# EAGLE design Pucati (EAGLE 7.7.0)
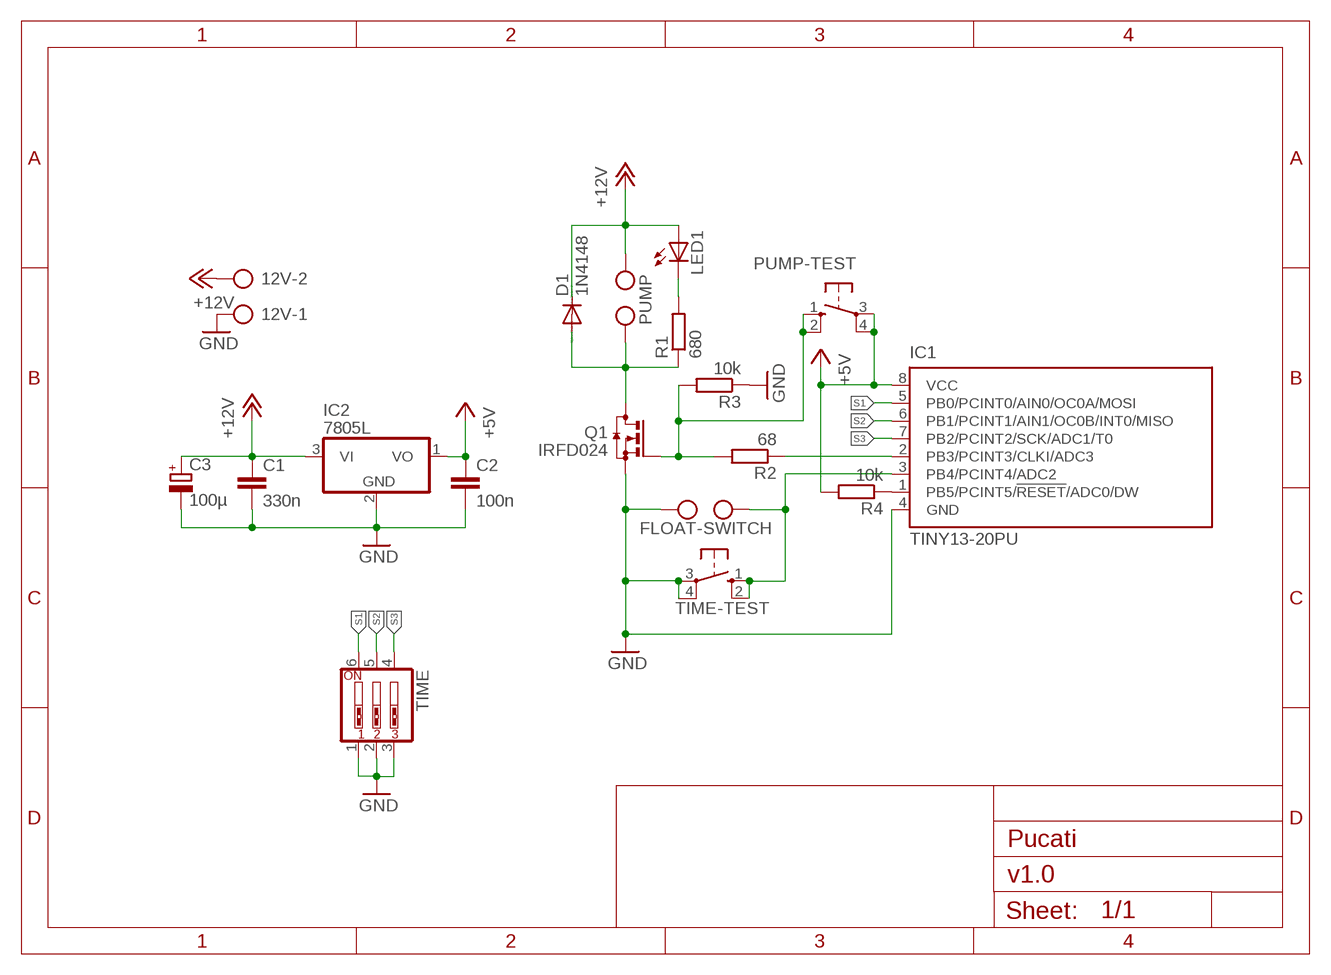
[diagram p0: schematic, sheet 1]

## Parts
12V  AK500/2  [AK500/2]
C1  330n  C-EUC1206  [C1206]
C2  100n  C-EUC1206  [C1206]
C3  100µ  CPOL-EUE2.5-5  [E2,5-5]
D1  1N4148  1N4148DO35-10  [DO35-10]
FLOAT-SWITCH  AK500/2  [AK500/2]
IC1  TINY13-20PU  [DIL08]
IC2  7805L  [TO92]
LED1  LED5MM  [LED5MM]
PUMP  AK500/2  [AK500/2]
PUMP-TEST  10-XX  [B3F-10XX]
Q1  IRFD024  [C370-01]
R1  680  R-EU_R1206  [R1206]
R2  68  R-EU_R1206  [R1206]
R3  10k  R-EU_R1206  [R1206]
R4  10k  R-EU_R1206  [R1206]
TIME  SW_DIP-3  [EDG-03]
TIME-TEST  10-XX  [B3F-10XX]

## Nets
+5V: C2.1 IC1.8(VCC) IC2.1(VO) PUMP-TEST.3(P) PUMP-TEST.4(P1) R4.2
+12V: 12V.2 C1.1 C3.+ D1.C IC2.3(VI) LED1.A PUMP.2
GND: 12V.1 C1.2 C2.2 C3.- FLOAT-SWITCH.2 IC1.4(GND) IC2.2(GND) Q1.S R3.1 TIME-TEST.3(P) TIME-TEST.4(P1) TIME.1 TIME.2 TIME.3
N$1: IC1.1(PB5/PCINT5/!RESET!/ADC0/DW) R4.1
N$2: D1.A PUMP.1 Q1.D Q1.D1(D) R1.1
N$3: LED1.K(C) R1.2
N$4: FLOAT-SWITCH.1 IC1.3(PB4/PCINT4/ADC2) TIME-TEST.1(S) TIME-TEST.2(S1)
N$5: IC1.2(PB3/PCINT3/CLKI/ADC3) R2.1
N$7: PUMP-TEST.1(S) PUMP-TEST.2(S1) Q1.G R2.2 R3.2
S1: IC1.5(PB0/PCINT0/AIN0/OC0A/MOSI) TIME.6
S2: IC1.6(PB1/PCINT1/AIN1/OC0B/INT0/MISO) TIME.5
S3: IC1.7(PB2/PCINT2/SCK/ADC1/T0) TIME.4

## Notes on the sheet
- PUMP
- FLOAT-SWITCH
- v1.0

## Library data of the parts
12V FLOAT-SWITCH PUMP = con-ptr500:AK500/2: CONNECTOR; OC_FARNELL: unknown; OC_NEWARK: unknown
C1 C2 = rcl:C-EU: CAPACITOR, European symbol
C3 = rcl:CPOL-EU: POLARIZED CAPACITOR, European symbol
D1 = diode:1N4148: DIODE high speed (Philips)
IC1 = atmel:TINY13: 8-bit AVR Microcontroller with 1K Bytes In-System Programmable Flash Source: http://www.atmel.com/dyn/resources/prod_documents/2535S.pdf; MPN: ATTINY13-20PU; OC_FARNELL: 9171550; OC_NEWARK: 96K6521
IC2 = linear:78*: Positive VOLTAGE REGULATOR Source: http://cache.national.com/ds/LM/LM78L05.pdf http://www.fairchildsemi.com/ds/LM/LM7805.pdf
LED1 = led:LED: LED OSRAM: - CHIPLED LG R971, LG N971, LY N971, LG Q971, LY Q971, LO R971, LY R971 LH N974, LH R974 LS Q976, LO Q976, LY Q976 LO Q996 - Hyper CHIPLED LW Q18S LB Q993, LB Q99A, LB R99A - SideLED LS A670, LO A670, LY A670, LG A670, LP A670 LB A673, LV A673, LT A673, LW A673 LH A674 LY A675 LS A676, LA A676, LO A676, LY A676, LW A676 LS A679, LY A679, LG A679 - Hyper Micro SIDELED® LS Y876, LA Y876, LO Y876, LY Y876 LT Y87S - SmartLED LW L88C, LW L88S LB L89C, LB L89S, LG L890 LS L89K, LO L89K, LY L89K LS L896, LA L896, LO L896, LY L896 - TOPLED LS T670, LO T670, LY T670, LG T670, LP T670 LSG T670, LSP T670, LSY T670, LOP T670, LYG T670 LG T671, LOG T671, LSG T671 LB T673, LV T673, LT T673, LW T673 LH T674 LS T676, LA T676, LO T676, LY T676, LB T676, LH T676, LSB T676, LW T676 LB T67C, LV T67C, LT T67C, LS T67K, LO T67K, LY T67K, LW E67C LS E67B, LA E67B, LO E67B, LY E67B, LB E67C, LV E67C, LT E67C LW T67C LS T679, LY T679, LG T679 LS T770, LO T770, LY T770, LG T770, LP T770 LB T773, LV T773, LT T773, LW T773 LH T774 LS E675, LA E675, LY E675, LS T675 LS T776, LA T776, LO T776, LY T776, LB T776 LHGB T686 LT T68C, LB T68C - Hyper Mini TOPLED® LB M676 - Mini TOPLED Santana® LG M470 LS M47K, LO M47K, LY M47K Source: http://www.osram.convergy.de LUXEON: - LUMILED® LXK2-PW12-R00, LXK2-PW12-S00, LXK2-PW14-U00, LXK2-PW14-V00 LXK2-PM12-R00, LXK2-PM12-S00, LXK2-PM14-U00 LXK2-PE12-Q00, LXK2-PE12-R00, LXK2-PE12-S00, LXK2-PE14-T00, LXK2-PE14-U00 LXK2-PB12-K00, LXK2-PB12-L00, LXK2-PB12-M00, LXK2-PB14-N00, LXK2-PB14-P00, LXK2-PB14-Q00 LXK2-PR12-L00, LXK2-PR12-M00, LXK2-PR14-Q00, LXK2-PR14-R00 LXK2-PD12-Q00, LXK2-PD12-R00, LXK2-PD12-S00 LXK2-PH12-R00, LXK2-PH12-S00 LXK2-PL12-P00, LXK2-PL12-Q00, LXK2-PL12-R00 Source: www.luxeon.com KINGBRIGHT: KA-3528ASYC Source: www.kingbright.com
PUMP-TEST TIME-TEST = switch-omron:10-XX: OMRON SWITCH; MPN: B3F-1000; OC_FARNELL: 176432; OC_NEWARK: 36M3542
Q1 = transistor-small-signal:IRFD024: P-CHANNEL MOS FET
R1-R4 = rcl:R-EU_: RESISTOR, European symbol
TIME = special:SW_DIP-3: DIP SWITCH

## Board
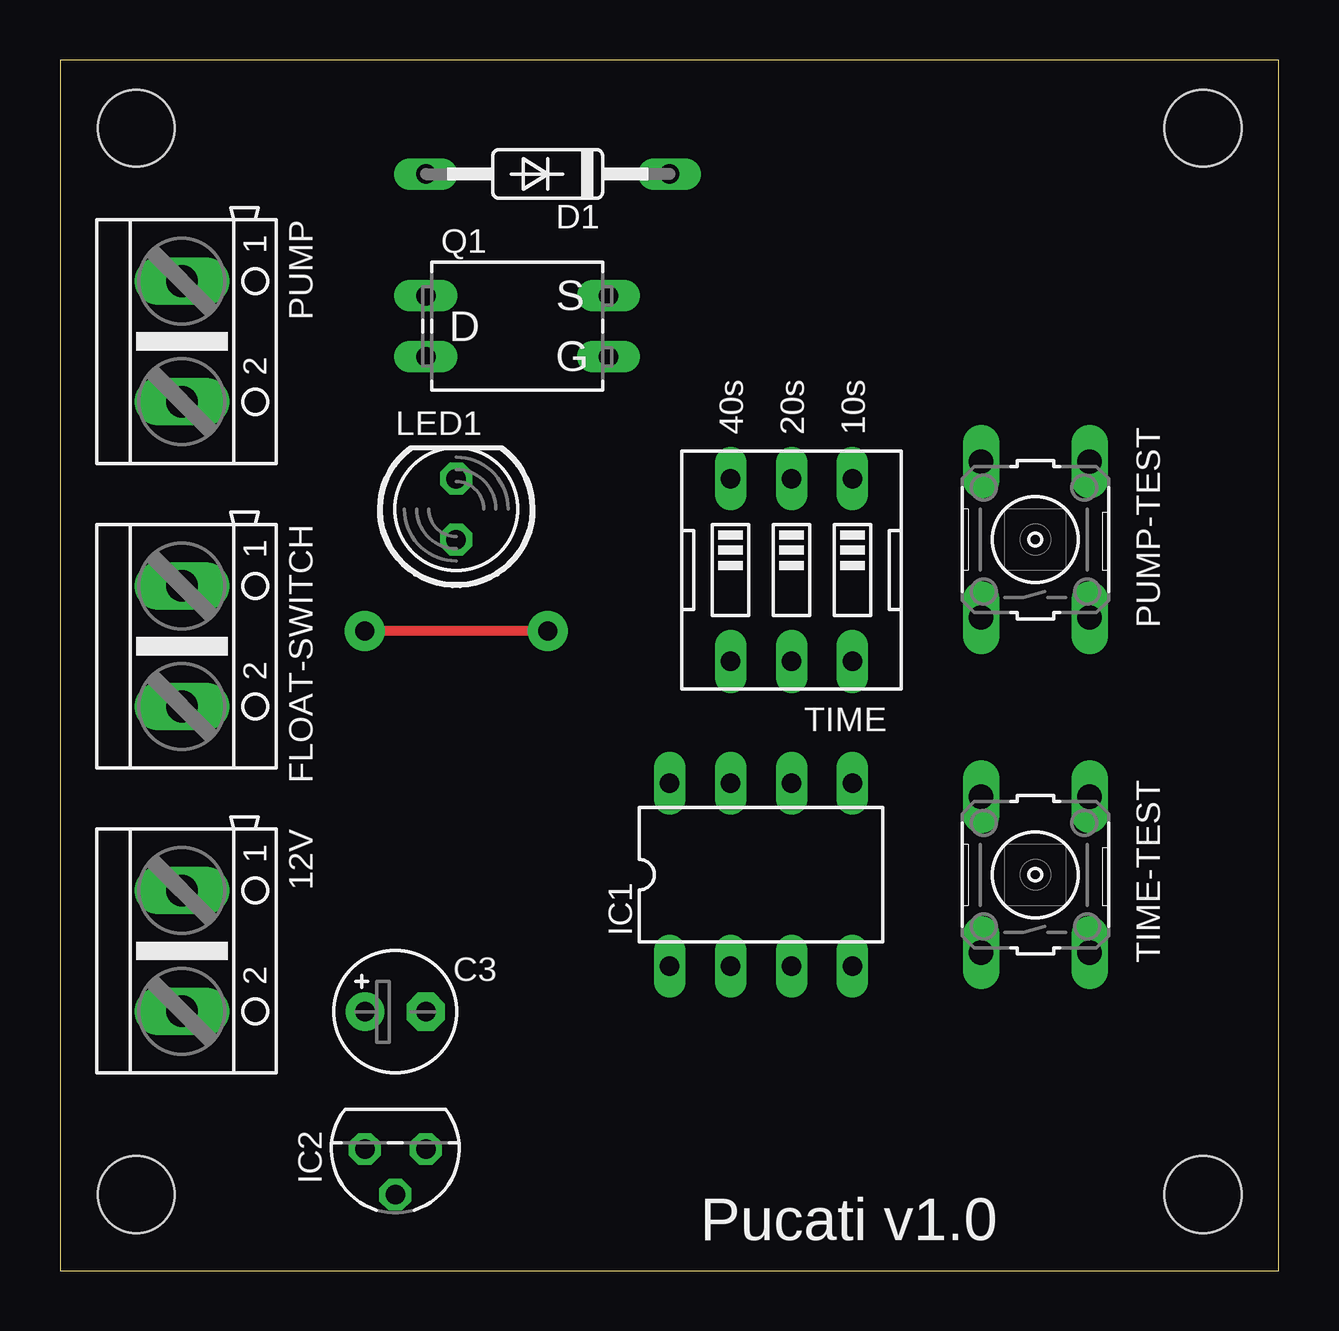
[diagram p1: board, top side]
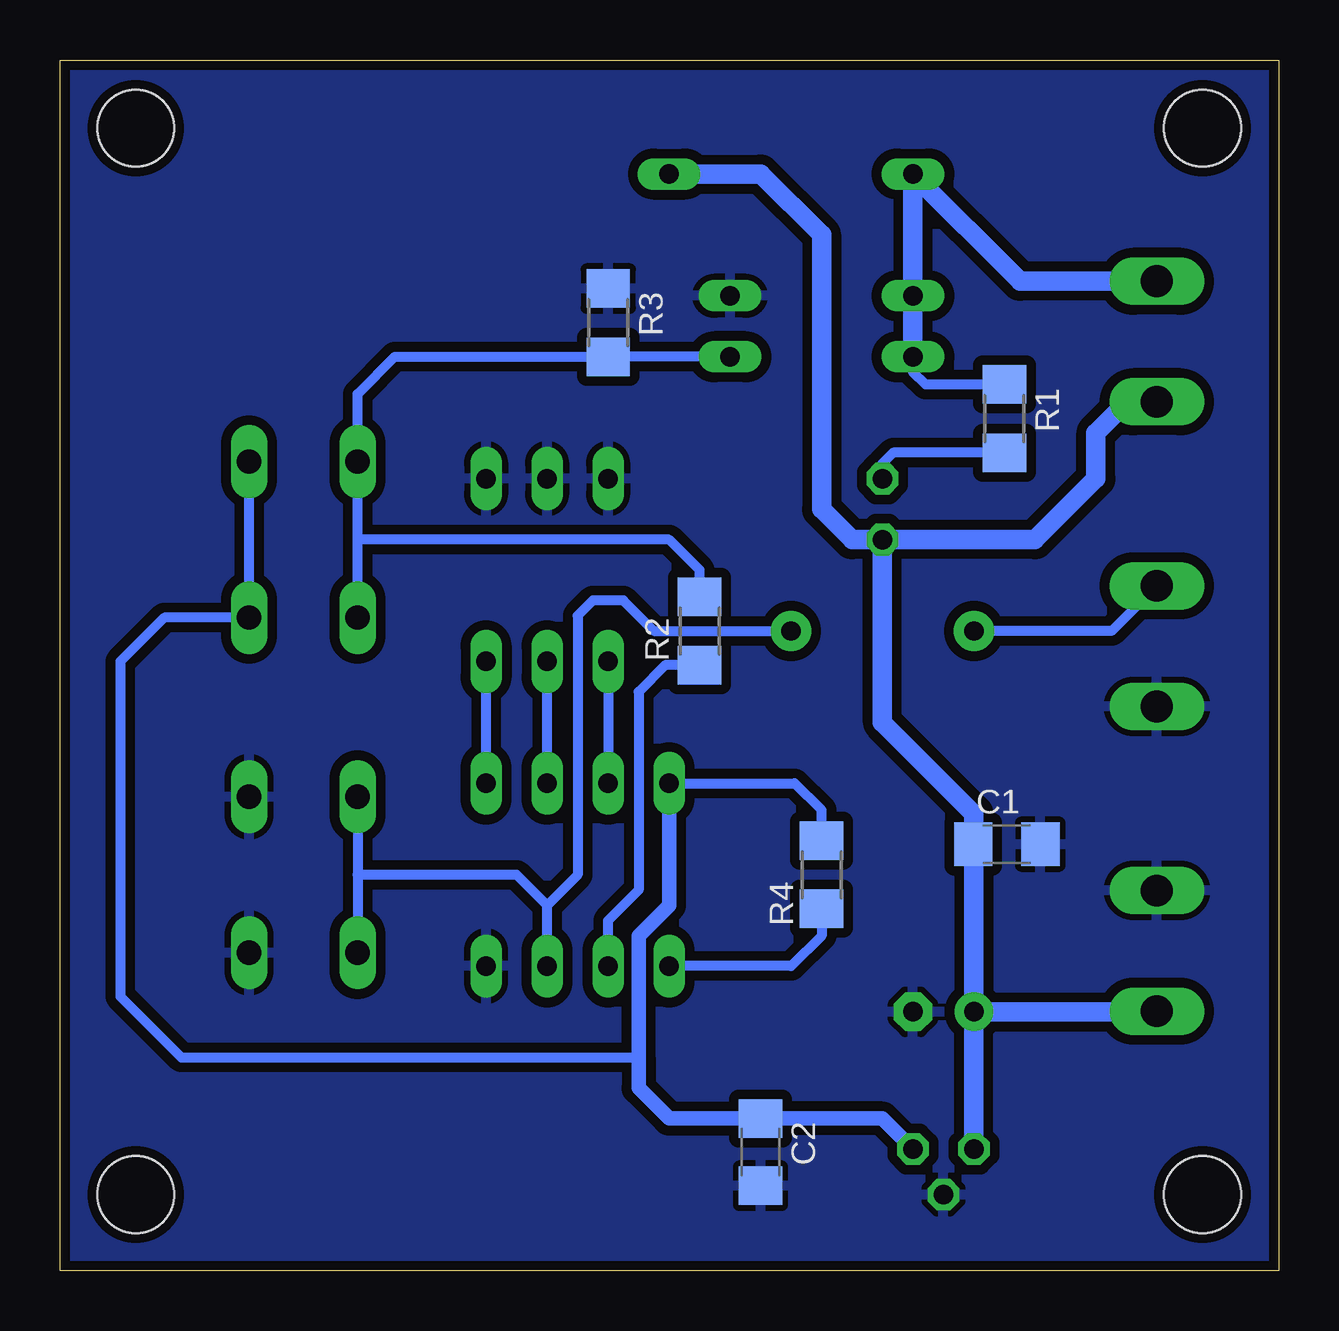
[diagram p2: board, bottom side, seen from below]

Size 50.78 x 50.47 mm. Coordinates in mm from the lower left corner, seen from the top.
Outline: 0,0 50.78,0 50.78,50.47 0,50.47 0,0
Copper layers (1*16): Top 0.035mm / dielectric 1.5mm / Bottom 0.035mm
Design rules "JLCPCB": minimum track width 5mil, minimum drill 12mil, track to track 5mil, track to pad 5mil, pad to pad 5mil, via to via 5mil, smd to smd 0mil, copper to edge 10mil, drill to drill 10mil, minimum pad ring 10mil, minimum via ring 6mil, stop-mask expansion 2mil, vias tented up to drill 25mil, thermal gap 10mil
Holes 3.2 mm at 3.17,47.62 3.17,3.17 47.62,47.62 47.62,3.17

### Footprints (pad centres in the part's own frame; a part is rotated, then mirrored left to right if it is on the bottom)
AK500/2 = drill 1.321 long: 1 -2.515,0; 2 2.515,0
C1206 = smd 1.6 x 1.8: 1 -1.4,0; 2 1.4,0
E2,5-5 = drill 0.813 pad 1.6: + -1.27,0 | drill 0.813 pad 1.6 octagon: - 1.27,0
DO35-10 = drill 0.813 long: A 5.08,0; C -5.08,0
DIL08 = drill 0.813 long: 1 -3.81,-3.81; 2 -1.27,-3.81; 3 1.27,-3.81; 4 3.81,-3.81; 5 3.81,3.81; 6 1.27,3.81; 7 -1.27,3.81; 8 -3.81,3.81
TO92 = drill 0.813 octagon: 1 -1.27,0; 2 0,1.905; 3 1.27,0
LED5MM = drill 0.813 octagon: A -1.27,0; K 1.27,0
B3F-10XX = drill 1.016 long: 1 -3.251,2.261; 2 3.251,2.261; 3 -3.251,-2.261; 4 3.251,-2.261
C370-01 = drill 0.813 long: D -3.81,1.27; D1 -3.81,-1.27; G 3.81,-1.27; S 3.81,1.27
R1206 = smd 1.6 x 1.803: 1 -1.422,0; 2 1.422,0
EDG-03 = drill 0.813 long: 1 -2.54,-3.81; 2 0,-3.81; 3 2.54,-3.81; 4 2.54,3.81; 5 0,3.81; 6 -2.54,3.81

### Placement (x,y rotation side)
12V  5.08,13.34 270 top
C1  11.33,17.78 0 bottom
C2  21.59,4.95 270 bottom
C3  13.97,10.79 0 top
D1  20.32,45.72 180 top
FLOAT-SWITCH  5.08,26.04 270 top
IC1  29.21,16.51 0 top
IC2  13.97,5.08 180 top
LED1  16.51,31.75 90 top
PUMP  5.08,38.73 270 top
PUMP-TEST  40.64,30.48 90 top
Q1  19.05,39.37 0 top
R1  11.43,35.52 270 bottom
R2  24.13,26.67 90 bottom
R3  27.94,39.52 270 bottom
R4  19.05,16.51 90 bottom
TIME  30.48,29.21 180 top
TIME-TEST  40.64,16.51 90 top

### Tracks (layer width: path | path; a pad name or v marks a point on that pad's centre or on a via)
+5V
  Bottom 0.406: IC1.8 20.17,20.32 19.05,19.2 R4.2 | PUMP-TEST.4 PUMP-TEST.3 46.43,27.23 48.26,25.4 48.26,11.43 45.72,8.89 26.67,8.89
  Bottom 0.61: IC2.1 16.51,6.35 C2.1 25.4,6.35 26.67,7.62 26.67,8.89 26.67,13.97 25.4,15.24 IC1.8
+12V
  Bottom 0.813: IC2.3 C3.+ | C3.+ 12.7,16.48 C1.1 12.7,16.54 12.7,19.05 16.51,22.86 LED1.A | D1.C 21.59,45.72 19.05,43.18 19.05,31.75 17.78,30.48 LED1.A | LED1.A 10.16,30.48 7.62,33.02 7.62,34.92 6.35,36.2 5.11,36.2 PUMP.2 | C3.+ 5.08,10.79 12V.2
GND
  pour Bottom (isolate 0.406): 0,50.8 0,0 50.8,0 50.8,50.8
N$1
  Bottom 0.406: R4.1 19.05,13.97 20.32,12.7 IC1.1
N$2
  Bottom 0.406: Q1.D1 15.24,37.47 14.72,36.94 R1.1
  Bottom 0.813: Q1.D1 Q1.D D1.A 10.77,41.25 PUMP.1
N$3
  Bottom 0.406: LED1.K 16.51,33.66 16.07,34.1 R1.2
N$4  (via drill 0.8 pad 1.68)
  Top 0.406: v20.32,26.67 v12.7,26.67
  Bottom 0.406: IC1.3 30.48,15.24 | 30.48,15.24 31.75,16.51 38.38,16.51 | 30.48,15.24 29.21,16.51 29.21,27.3 28.57,27.94 27.3,27.94 26.04,26.67 v20.32,26.67 | TIME-TEST.2 38.38,16.51 | 38.38,16.51 TIME-TEST.1 | FLOAT-SWITCH.1 6.96,26.67 v12.7,26.67
N$5
  Bottom 0.406: IC1.2 27.94,14.61 26.67,15.88 26.67,24.13 25.55,25.25 R2.1
N$7
  Bottom 0.406: PUMP-TEST.1 38.38,30.48 | 38.38,30.48 PUMP-TEST.2 38.38,36.55 36.83,38.1 R3.2 Q1.G | R2.2 24.13,29.21 25.4,30.48 38.38,30.48
S1
  Bottom 0.406: IC1.5 TIME.6
S2
  Bottom 0.406: IC1.6 TIME.5
S3
  Bottom 0.406: TIME.4 IC1.7

### Text on the board
tNames: 40s | 20s | 10s | Pucati v1.0